# EAGLE design Grove - Alcohol Sensor v1.2 (EAGLE 6.4)

## Sheet 1 of 2
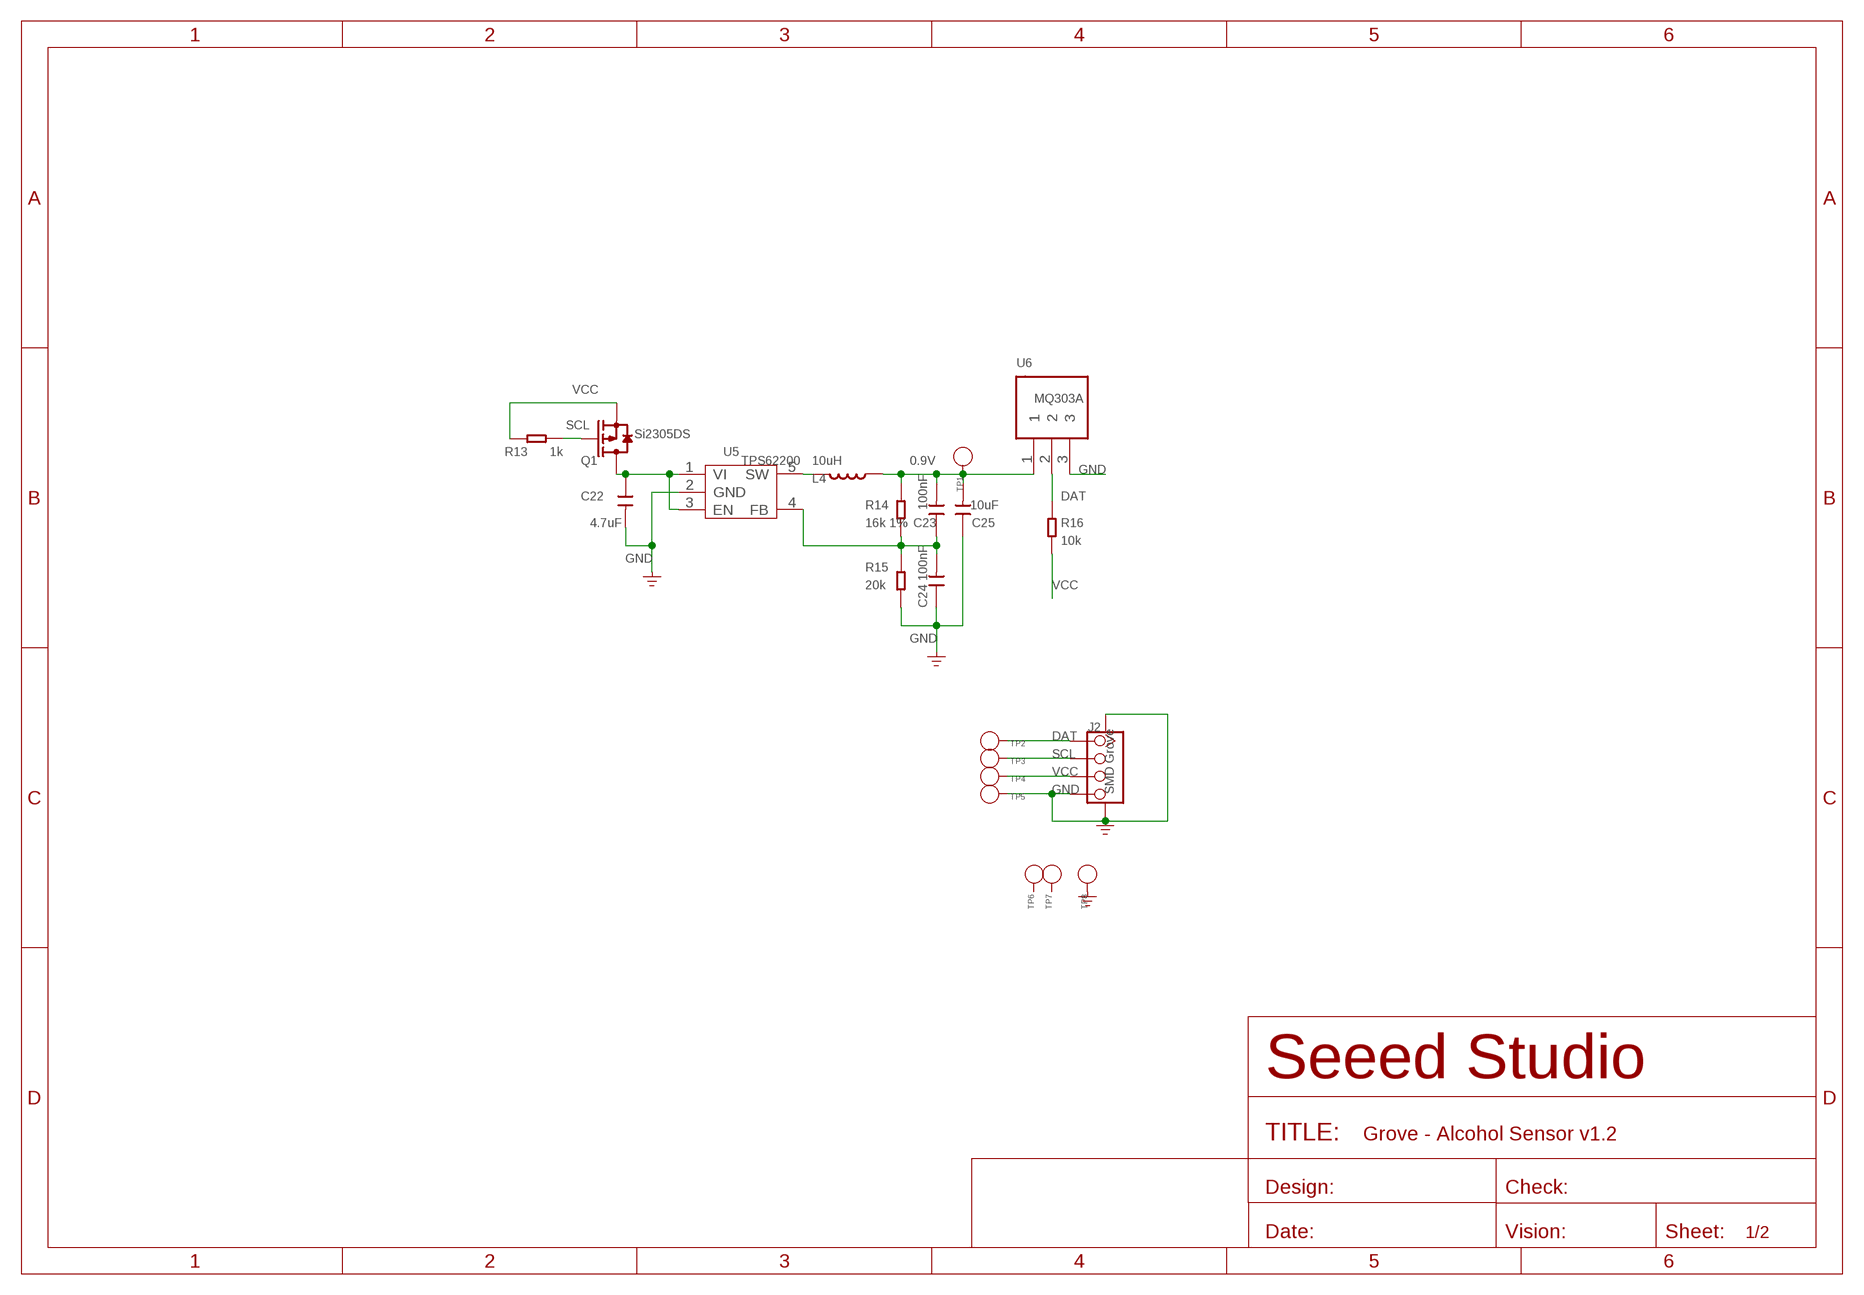
[diagram p0: schematic, sheet 1]

### Parts
C22  4.7uF  C-0805  [C0805]
C23  100nF  C-0603  [C0603]
C24  100nF  C-0603  [C0603]
C25  10uF  C-0805  [C0805]
J2  SMD Grove  TWIG-4P-2.0-SMD-FEMALE-REINFORCE'DD'  [4P-SMD-2.0]
L4  10uH  L'PIO73'  [PIO73]
Q1  Si2305DS  MOSFET-P'SI2323CDS/SI2305DS<BR>'  [SOT23]
R13  1k  R-0603  [R0603]
R14  16k 1%  R-0603  [R0603]
R15  20k  R-0603  [R0603]
R16  10k  R-0603  [R0603]
TP1  PAD-TEST-POINT'4545'  [TP_4545]
TP2  PAD-TEST-POINT'4545'  [TP_4545]
TP3  PAD-TEST-POINT'4545'  [TP_4545]
TP4  PAD-TEST-POINT'4545'  [TP_4545]
TP5  PAD-TEST-POINT'4545'  [TP_4545]
TP6  PAD-TEST-POINT'4545'  [TP_4545]
TP7  PAD-TEST-POINT'4545'  [TP_4545]
TP8  PAD-TEST-POINT'4545'  [TP_4545]
U5  TPS62200  TPS62200DBV  [SOT23-5]
U6  MQ303A  [MQ303A]

### Nets
0.9V: C23.2 C25.2 L4.2 R14.1 TP1.T U6.1
DAT: J2.1 R16.1 TP2.T U6.2
GND: C22.2 C24.1 C25.1 J2.4 J2.SS1 J2.SS2 R15.2 TP5.T TP8.T U5.2(GND) U6.3
N$18: C22.1 Q1.3(D) U5.1(VI) U5.3(EN)
N$21: L4.1 U5.5(SW)
N$23: C23.1 C24.2 R14.2 R15.1 U5.4(FB)
SCL: J2.2 Q1.1(G) R13.1 TP3.T
VCC: J2.3 Q1.2(S) R13.2 R16.2 TP4.T
Unconnected: TP6.T TP7.T

## Sheet 2 of 2
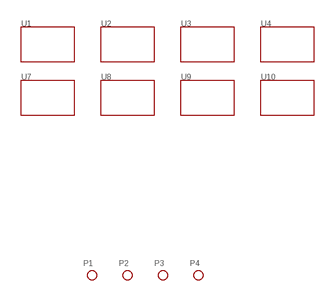
[diagram p1: schematic, sheet 2]

### Parts
P1  PAD-MARK  [ROUND-MARK-1.0]
P2  PAD-MARK  [ROUND-MARK-1.0]
P3  PAD-MARK  [ROUND-MARK-1.0]
P4  PAD-MARK  [ROUND-MARK-1.0]
U1  TWIG'2U'  [GROVE-TEST-PLATFORM]
U2  TWIG'2U'  [GROVE-TEST-PLATFORM]
U3  TWIG'2U'  [GROVE-TEST-PLATFORM]
U4  TWIG'2U'  [GROVE-TEST-PLATFORM]
U7  TWIG'2U'  [GROVE-TEST-PLATFORM]
U8  TWIG'2U'  [GROVE-TEST-PLATFORM]
U9  TWIG'2U'  [GROVE-TEST-PLATFORM]
U10  TWIG'2U'  [GROVE-TEST-PLATFORM]

## Library data of the parts
C22-C25 = Discrete:C*: Ceramic Capacitors
J2 = Connector:TWIG-4P-2.0-SMD-FEMALE-REINFORCE
L4 = Discrete:L*
P1-P4 = Discrete:PAD-MARK; PARTNO: DNP
Q1 = Discrete:MOSFET-P
R13-R16 = Discrete:R*
TP1-TP8 = Discrete:PAD-TEST-POINT; PARTNO: DNP
U1-U4 U7-U10 = template:TWIG
U5 = IC:TPS62200: High-Efficiency,SOT23 STEP-DOWN,DC-DC Converter
U6 = MQ303A:MQ303A

## Board
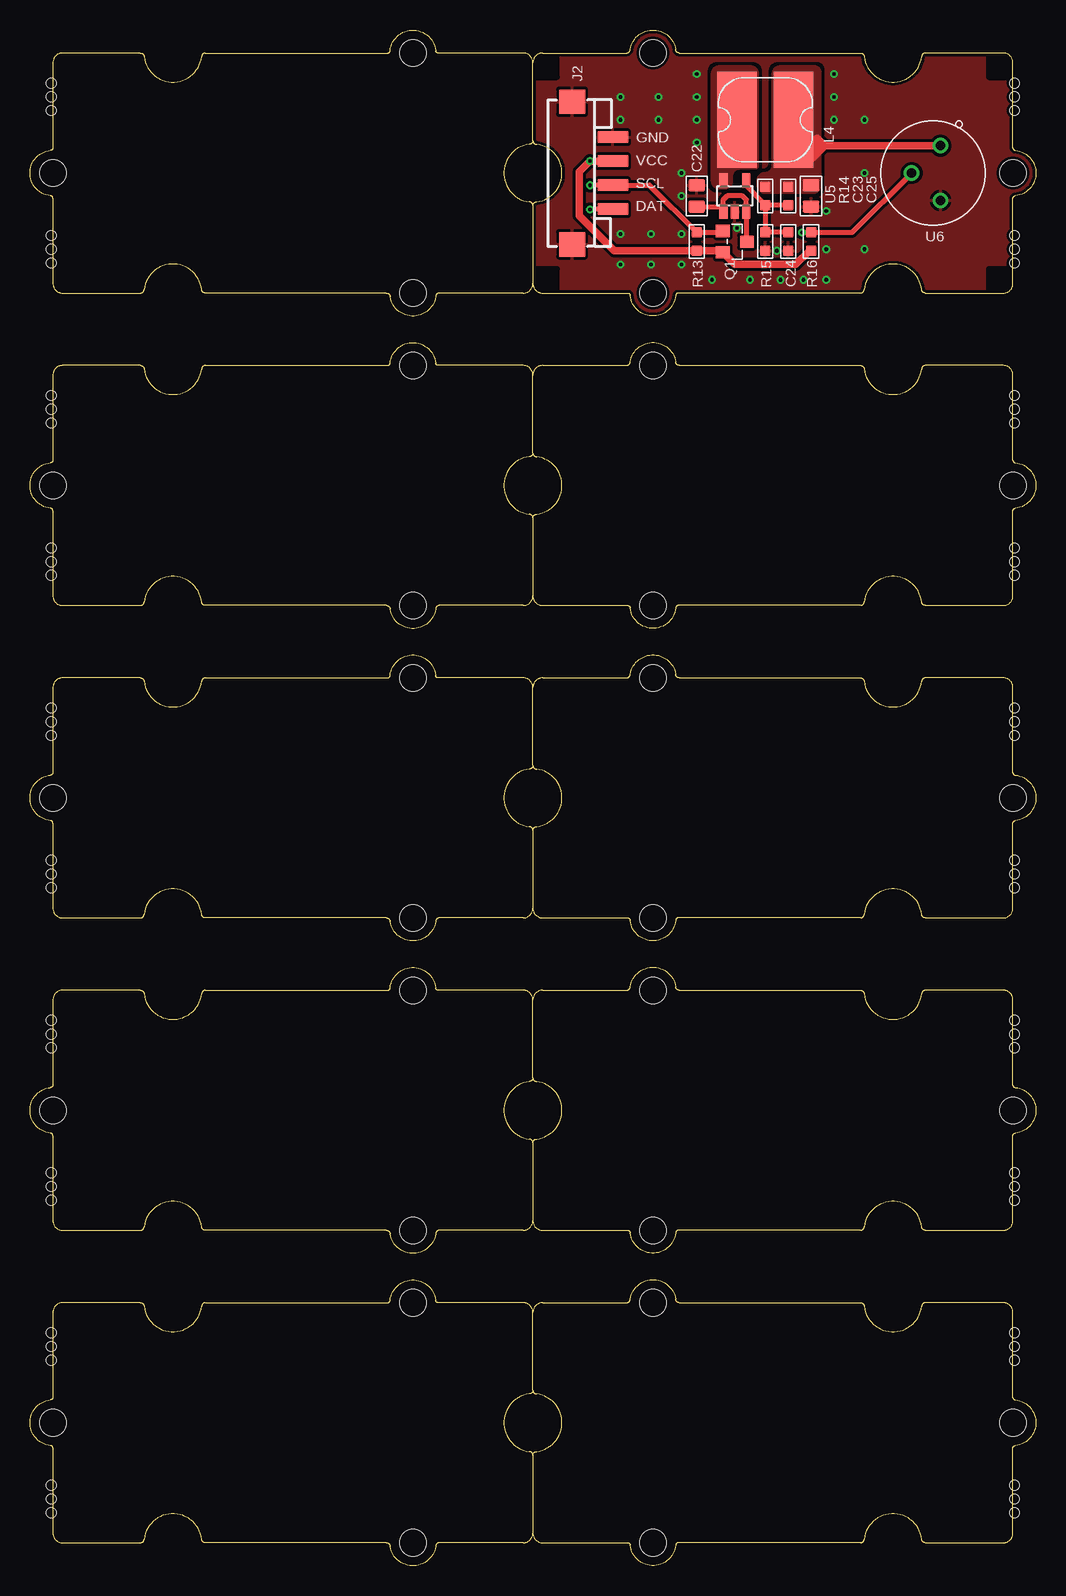
[diagram p2: board, top side]
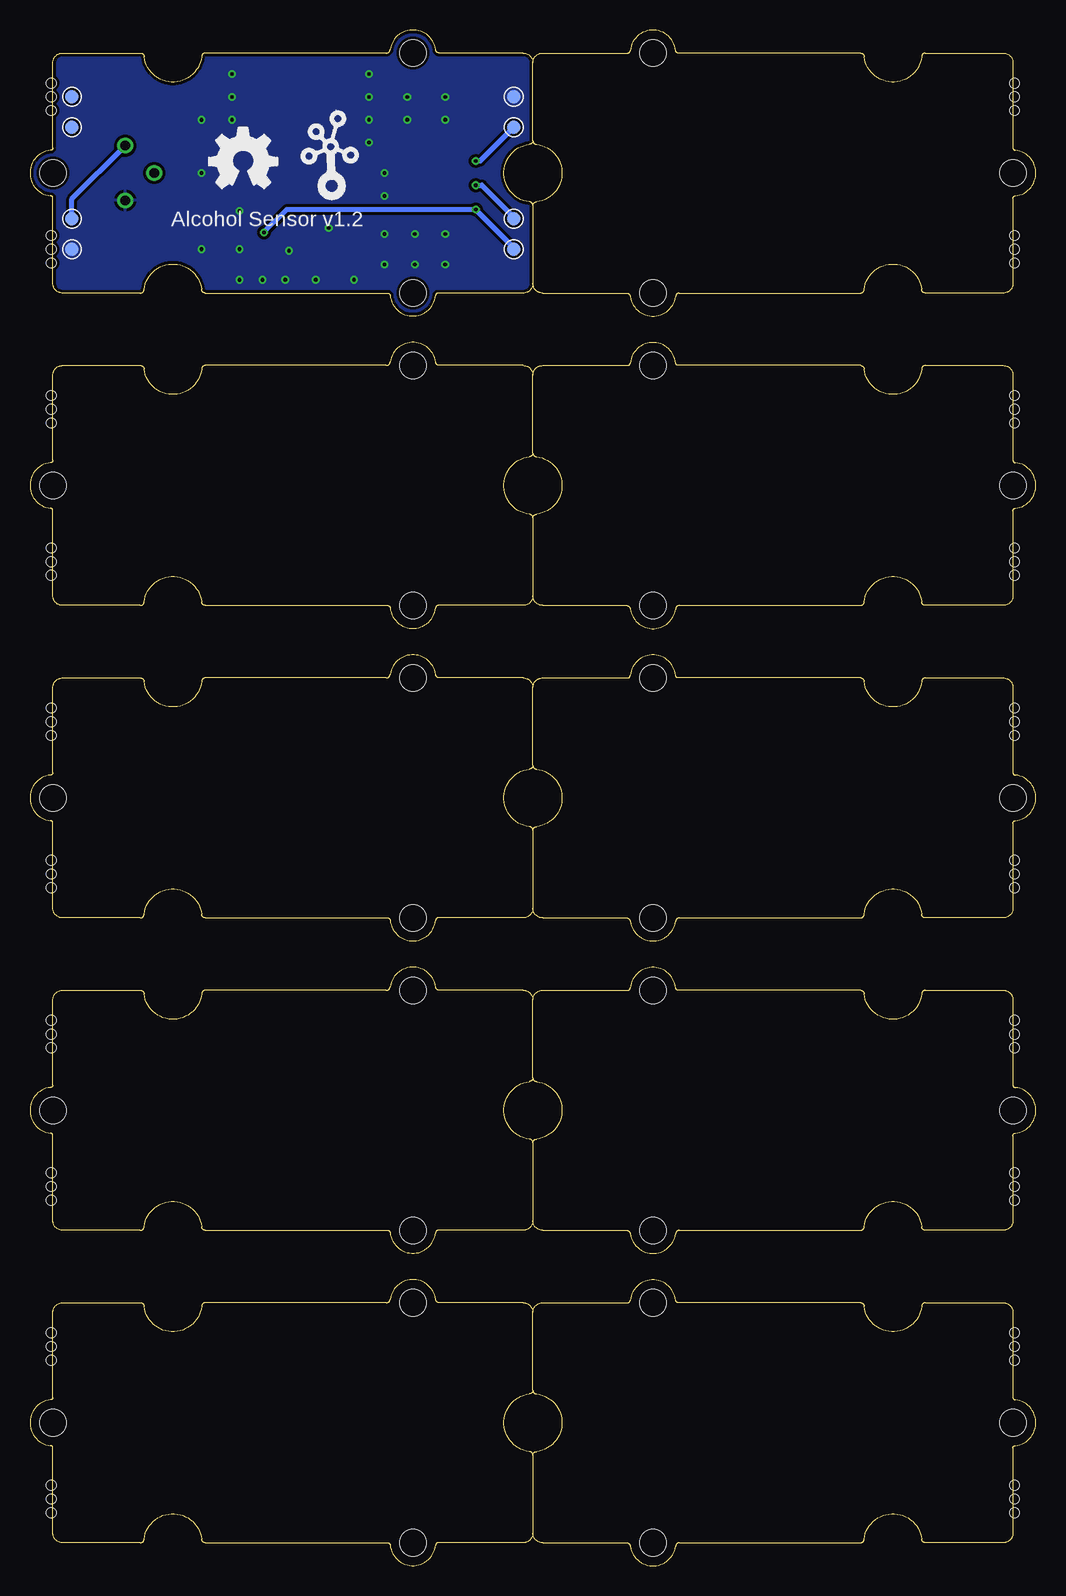
[diagram p3: board, bottom side, seen from below]

Size 83.82 x 127.98 mm. Coordinates in mm from the lower left corner, seen from the top.
Copper layers (1*16): Top 0.035mm / dielectric 1.5mm / Bottom 0.035mm
Design rules "SeeedStudio_2layer_DRU_no_angle_20140221 *": minimum track width 6mil, minimum drill 12mil, track to track 6mil, track to pad 6mil, pad to pad 6mil, via to via 6mil, smd to smd 0mil, copper to edge 10mil, drill to drill 10mil, minimum pad ring 10mil, minimum via ring 6mil, stop-mask expansion 2mil, vias tented up to drill 100mil, thermal gap 10mil
Holes 0.8 mm at 1.78,123.55 1.78,121.27 1.78,122.41 1.78,110.85 1.78,108.57 1.78,109.71 1.78,97.52 1.78,95.23 1.78,96.38 1.78,84.82 1.78,82.53 1.78,83.68 1.78,71.48 1.78,69.2 1.78,70.34 1.78,58.78 1.78,56.5 1.78,57.64 1.78,45.45 1.78,43.16 1.78,44.31 1.78,32.75 1.78,30.46 1.78,31.61 1.78,19.41 1.78,17.13 1.78,18.27 1.78,6.71 1.78,4.43 1.78,5.57 82.04,121.27 82.04,123.55 82.04,122.41 82.04,108.57 82.04,110.85 82.04,109.71 82.04,95.23 82.04,97.52 82.04,96.38 82.04,82.53 82.04,84.82 82.04,83.68 82.04,69.2 82.04,71.48 82.04,70.34 82.04,56.5 82.04,58.78 82.04,57.64 82.04,43.16 82.04,45.45 82.04,44.31 82.04,30.46 82.04,32.75 82.04,31.61 82.04,17.13 82.04,19.41 82.04,18.27 82.04,4.43 82.04,6.71 82.04,5.57
Holes 1.91 mm at -4.13,2.4 87.95,2.4 87.95,125.59 -4.13,125.59

### Footprints (pad centres in the part's own frame; a part is rotated, then mirrored left to right if it is on the bottom)
C0805 = smd 1.016 x 1.397: 1 -0.889,0; 2 0.889,0
C0603 = smd 0.889 x 0.889: 1 -0.762,0; 2 0.762,0
4P-SMD-2.0 = smd 0.965 x 2.54: 1 -3,0; 2 -1,0; 3 1,0; 4 3,0 | smd 2.032 x 2.184: SS1 -5.946,3.4; SS2 5.946,3.4
PIO73 = smd 8 x 3.3: 1 0,2.35; 2 0,-2.35
ROUND-MARK-1.0 = smd 1.016 x 1.016: P$1 0,0
SOT23 = smd 1.016 x 1.143: 1 -0.889,-1.016; 2 0.889,-1.016; 3 0,1.016
R0603 = smd 0.889 x 0.889: 1 -0.762,0; 2 0.762,0
TP_4545 = smd 1.143 x 1.143: T 0,0
GROVE-TEST-PLATFORM = hole 2.2: -10,-10; -10,10; 20,0
SOT23-5 = smd 0.69 x 1.2: 1 -0.95,-1.3; 2 0,-1.3; 3 0.95,-1.3; 4 0.95,1.3; 5 -0.95,1.3
MQ303A = drill 0.8: 1 -2.286,0.635; 2 0,-1.778; 3 2.286,0.635
GROVE-2CONNECTOR-SMD = hole 2.2: -10,-10; -10,10; 20,0

### Placement (x,y rotation side)
C22  55.56,114.16 90 top
C23  63.18,114.16 90 top
C24  63.18,110.35 90 top
C25  65.09,114.16 90 top
J2  48.58,116.06 90 top
L4  61.28,120.51 90 top
P1  -4.13,7.48 0 top  (outside the outline)
P2  87.95,7.48 0 top  (outside the outline)
P3  -4.13,120.51 0 top  (outside the outline)
P4  87.95,120.51 0 top  (outside the outline)
Q1  58.74,110.35 270 top
R13  55.56,110.35 270 top
R14  61.28,114.16 270 top
R15  61.28,110.35 270 top
R16  65.09,110.35 270 top
TP1  80.33,112.25 0 bottom
TP2  43.5,109.71 0 bottom
TP3  43.5,112.25 0 bottom
TP4  43.5,119.87 0 bottom
TP5  43.5,122.41 0 bottom
TP6  80.33,122.41 0 bottom
TP7  80.33,119.87 0 bottom
TP8  80.33,109.71 0 bottom
U1  61.91,37.96 0 top
U2  21.91,37.96 180 top
U3  61.91,63.99 0 top
U4  21.91,63.99 180 top
U5  58.74,114.16 0 top
U6  75.25,116.06 270 top
U7  61.91,90.03 0 top
U8  21.91,90.03 180 top
U9  21.91,116.06 180 top
U10  61.91,116.06 0 top
U11  [GROVE-TEST-PLATFORM]  61.91,11.92 0 top
U12  [GROVE-TEST-PLATFORM]  21.91,11.92 180 top
U$2  [GROVE-2CONNECTOR-SMD]  61.91,116.06 0 top
U$7  [OSHW_FILLX200_NOTEXT]  68.9,114.79 0 bottom
U$8  [TWIGLOGO]  58.74,114.79 0 bottom

### Tracks (layer width: path | path; a pad name or v marks a point on that pad's centre or on a via)
0.9V
  Top 0.61: U6.1 66.23,118.35 | 66.23,118.35 64.07,118.35 63.82,118.6 63.82,120.32 L4.2 | 66.23,118.35 65.6,118.98 65.22,118.6 65.22,117.33 66.23,118.35
  Bottom 0.406: TP1.T 80.33,113.9 U6.1
  pour Top (isolate 0.254, no thermals): 61.91,124.32 61.91,116.7 arc-90 61.28,116.06 arc90 60.64,115.43 60.64,115.05 arc90 61.28,114.41 65.22,114.41 arc90 65.85,115.05 65.85,124.44 arc90 65.34,124.95 62.55,124.95 arc90
DAT  (via drill 0.3 pad 0.64)
  Top 0.406: J2.1 46.72,113.06 v46.67,113.01 | U6.2 68.52,111.11 R16.1 v64.33,111.11
  Bottom 0.406: TP2.T 43.5,109.84 v46.67,113.01 62.42,113.01 v64.33,111.11
GND  (via drill 0.3 pad 0.64)
  other vias: 54.29,116.06 62.23,109.58 58.93,111.49 54.29,110.98 51.75,110.98 49.21,110.98 54.29,114.16 66.36,109.71 66.36,107.17 62.55,107.17 60.01,107.17 56.83,107.17 54.29,108.44 51.75,108.44 49.21,108.44 64.45,107.17 66.99,124.32 66.99,122.41 55.56,124.32 55.56,122.41 55.56,120.51 55.56,118.6 66.36,112.89 66.99,120.51 69.53,116.06 69.53,120.51 69.53,109.71 52.39,120.51 49.21,120.51 52.39,122.41 49.21,122.41
  pour Bottom (isolate 0.254, rank 6): 41.59,128.13 84.14,128.13 84.14,105.27 84.14,104 41.59,104
  pour Top (isolate 0.254, rank 6): 41.59,128.13 84.14,128.13 84.14,105.27 84.14,104 41.59,104
N$18
  Top 0.406: Q1.3 59.75,110.22 59.69,110.29 U5.3 59.69,113.84 59.37,114.16 58.1,114.16 57.79,113.84 57.79,113.14 | U5.1 57.79,113.14 | C22.1 57.66,113.27 57.79,113.14
N$21
  pour Top (isolate 0.254, no thermals): 60.64,124.32 60.64,116.7 arc-90 60.39,116.44 59.12,116.44 arc90 58.48,115.81 58.48,115.43 arc-90 57.85,114.79 57.47,114.79 arc-90 56.83,115.43 56.83,124.32 arc-90 57.47,124.95 60.01,124.95 arc-90
N$23
  Top 0.406: C24.2 61.53,111.11 61.41,110.98 R15.1 R14.2 | C23.1 R14.2 | U5.4 59.69,114.98 R14.2
SCL  (via drill 0.3 pad 0.64)
  Top 0.406: v46.67,115.05 46.69,115.06 J2.2 51.61,115.06 R13.1 57.6,111.11 Q1.1
  Bottom 0.406: v46.67,115.05 46.17,115.05 43.5,112.38 TP3.T
VCC  (via drill 0.3 pad 0.64)
  Top 0.61: J2.3 46.69,117.06 v46.67,117.08 45.78,116.19 45.78,112.51 48.71,109.58 R13.2 57.6,109.58 Q1.2 58.74,108.44 63.82,108.44 64.96,109.58 R16.2
  Bottom 0.406: v46.67,117.08 46.29,117.08 TP4.T

### Text on the board
tPlace: GND | VCC | SCL | DAT
bPlace: Alcohol Sensor v1.2